# EasyEDA schematic SCH_step-count_2025-07-05.json
TITLE: Step Count; REV: 1.0; Date: 2025-06-23; Sheet: 1/1; Drawn By: kcankit115; Company: Your Company
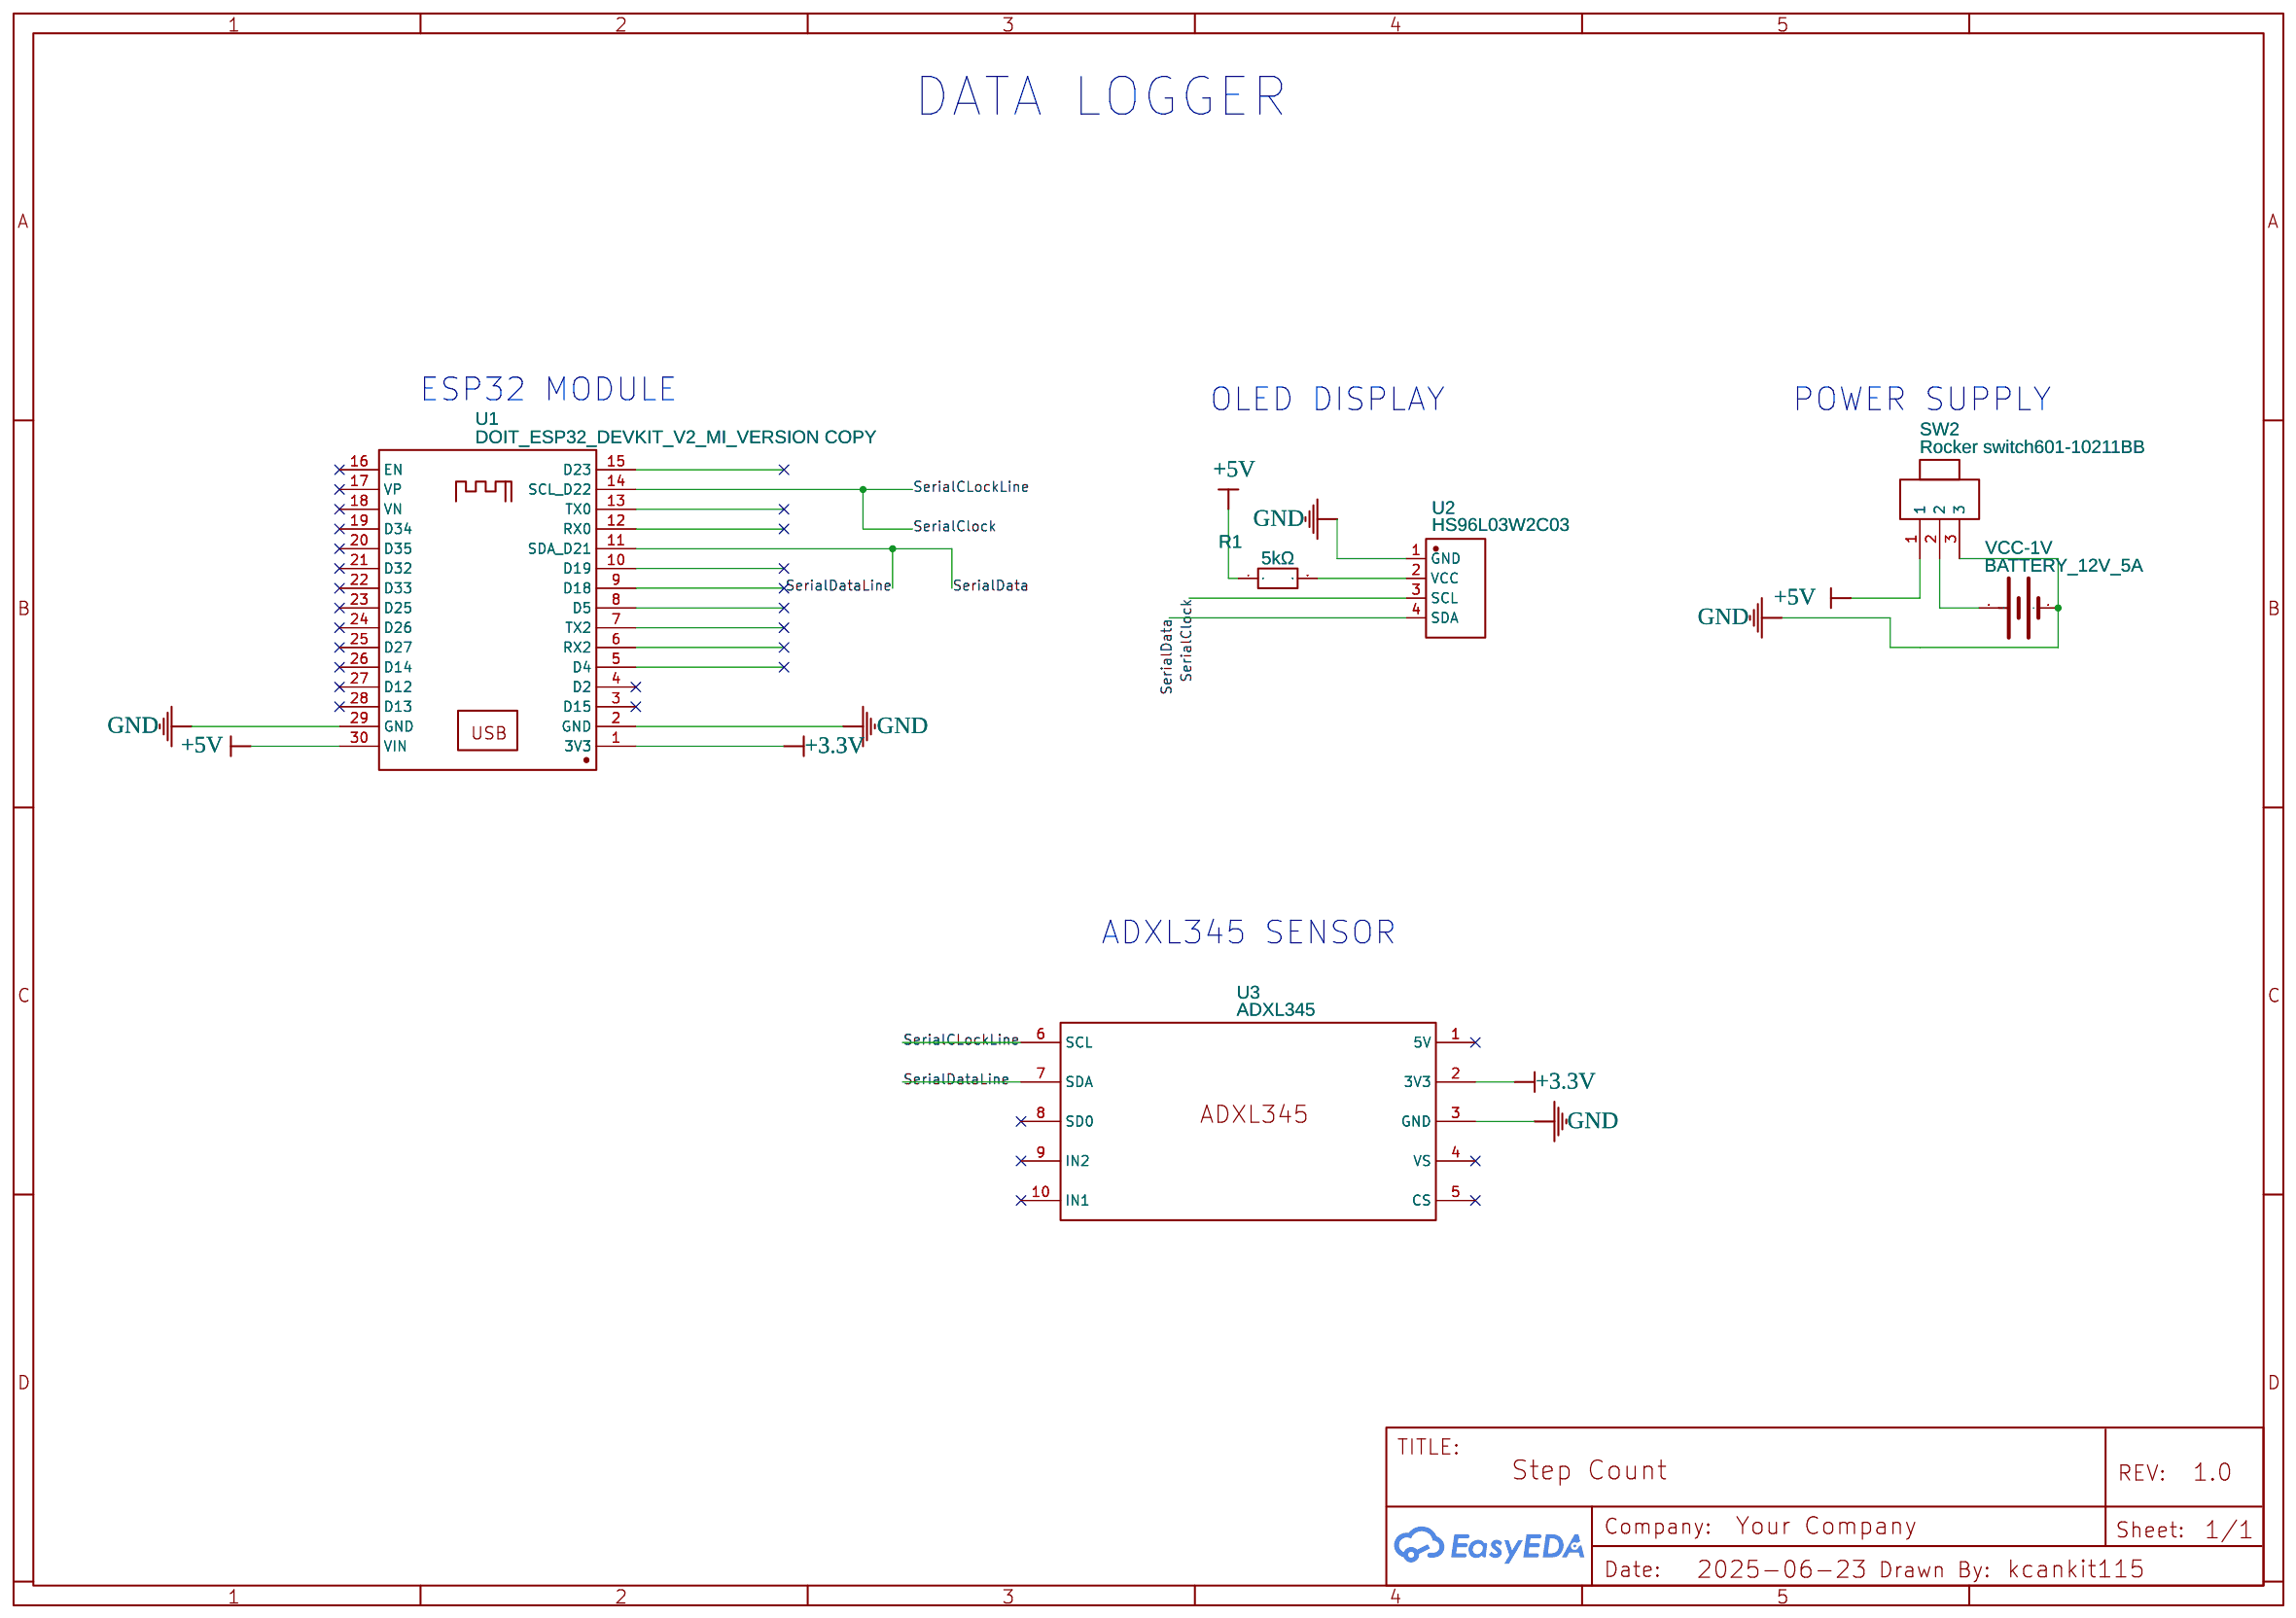
[diagram p0: schematic sheet]

## Parts
R1  5kΩ  [RES-TH_BD2.3-L6.5-P10.50-D0.5]
SW2  Rocker switch601-10211BB  [SW-TH_601-10211BB]
U1  DOIT_ESP32_DEVKIT_V2_MI_VERSION COPY  [DOIT_ESP32_DEVKIT_V2]
U2  HS96L03W2C03  [OLED-TH_L27.8-W27.2-P2.54_C9900033791]
U3  ADXL345  [ADXL345]
VCC-1V  BATTERY_12V_5A  [BATTERY-12V-27A]

## Library data of the parts
R1 = MF1/4W-1KΩ±1%T52 COPY: Contributor: LCSC; Supplier: LCSC; Supplier Part: C713997; Manufacturer: 华星机电; Manufacturer Part: MF1/4W-1KΩ±1%T52; JLCPCB Part Class: Extended Part
SW2 = Rocker switch601-10211BB: Supplier: LCSC; Manufacturer: BBJ; Supplier Part: C67849
U1 = DOIT_ESP32_DEVKIT_V2_MI_VERSION COPY: Supplier: LCSC; Supplier Part: ESP32; Contributor: ENGELTRONICS
U2 = HS96L03W2C03: Contributor: lcsc; Supplier: LCSC; Supplier Part: C5248080; Manufacturer: HS(汉昇); JLCPCB Part Class: Extended Part
U3 = ADXL345: link: https://www.hestore.hu/prod_10035567.html; Contributor: karad.social
VCC-1V = BATTERY_12A_27A: Contributor: irukaict

## Nets
+3.3V: U1.1(3V3) U3.2(3V3)
+5V: R1.1 SW2.1 U1.30(VIN)
GND: SW2.3 U1.2(GND) U1.29(GND) U2.1(GND) U3.3(GND) VCC-1V.1(-)
SerialCLockLine: U1.14(SCL D22) U2.3(SCL) U3.6(SCL)
SerialData: U1.11(SDA D21) U2.4(SDA) U3.7(SDA)
Net-(R1-2): R1.2 U2.2(VCC)
Net-(SW2-2): SW2.2 VCC-1V.2(+)

Not connected (* = marked no-connect by the designer): U1 3(D15)* 4(D2)* 5(D4) 6(RX2) 7(TX2) 8(D5) 9(D18) 10(D19) 12(RX0) 13(TX0) 15(D23) 16(EN)* 17(VP)* 18(VN)* 19(D34)* 20(D35)* 21(D32)* 22(D33)* 23(D25)* 24(D26)* 25(D27)* 26(D14)* 27(D12)* 28(D13)*; U3 1(5V)* 4(VS)* 5(CS)* 8(SD0)* 9(IN2)* 10(IN1)*

## Notes on the sheet
- DATA LOGGER
- ESP32 MODULE
- OLED DISPLAY
- POWER SUPPLY
- ADXL345 SENSOR
